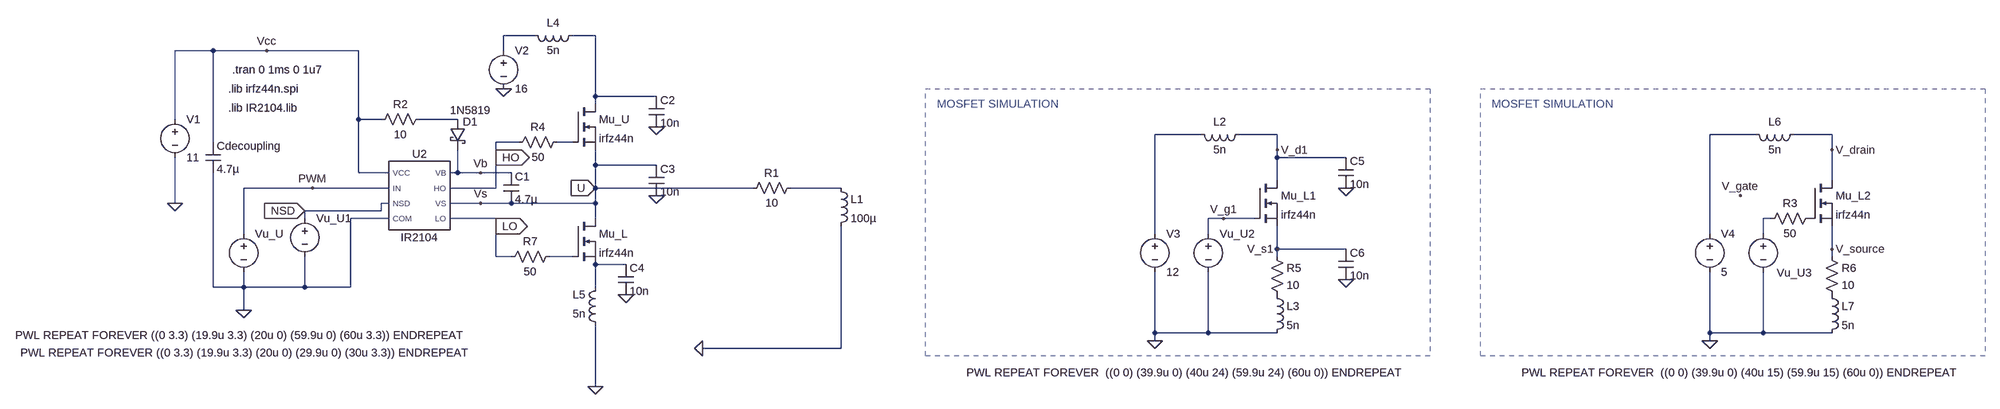
[diagram p0: schematic single_fet_driver.asc]
single_fet_driver.asc, the LTspice schematic file:
Version 4
SHEET 1 3064 1880
WIRE -528 -640 -592 -640
WIRE -400 -640 -448 -640
WIRE -1200 -608 -1280 -608
WIRE -1088 -608 -1200 -608
WIRE -896 -608 -1088 -608
WIRE -592 -608 -592 -640
WIRE -400 -512 -400 -640
WIRE -272 -512 -400 -512
WIRE -400 -496 -400 -512
WIRE -1280 -464 -1280 -608
WIRE -896 -464 -896 -608
WIRE -848 -464 -896 -464
WIRE -688 -464 -768 -464
WIRE 992 -432 896 -432
WIRE 1152 -432 1072 -432
WIRE 2160 -432 2064 -432
WIRE 2320 -432 2240 -432
WIRE -1200 -416 -1200 -608
WIRE -560 -416 -608 -416
WIRE -448 -416 -480 -416
WIRE 1152 -400 1152 -432
WIRE 2320 -400 2320 -432
WIRE -608 -384 -608 -416
WIRE 1152 -384 1152 -400
WIRE 1296 -384 1152 -384
WIRE -400 -368 -400 -400
WIRE -272 -368 -400 -368
WIRE -896 -352 -896 -464
WIRE -832 -352 -896 -352
WIRE -688 -352 -688 -400
WIRE -688 -352 -704 -352
WIRE -640 -352 -688 -352
WIRE -576 -352 -640 -352
WIRE 1152 -336 1152 -384
WIRE 2320 -336 2320 -400
WIRE -992 -320 -1136 -320
WIRE -832 -320 -992 -320
WIRE -608 -320 -608 -384
WIRE -608 -320 -704 -320
WIRE -400 -320 -400 -368
WIRE -64 -320 -400 -320
WIRE 128 -320 16 -320
WIRE -1280 -288 -1280 -384
WIRE -832 -288 -848 -288
WIRE -640 -288 -704 -288
WIRE -576 -288 -640 -288
WIRE -400 -288 -400 -320
WIRE -400 -288 -576 -288
WIRE -848 -272 -848 -288
WIRE -848 -272 -1008 -272
WIRE -1008 -256 -1008 -272
WIRE -832 -256 -912 -256
WIRE -608 -256 -704 -256
WIRE -400 -256 -400 -288
WIRE 1040 -256 1008 -256
WIRE 1104 -256 1040 -256
WIRE 2192 -256 2176 -256
WIRE -608 -240 -608 -256
WIRE -1136 -224 -1136 -320
WIRE 896 -224 896 -432
WIRE 1008 -224 1008 -256
WIRE 2064 -224 2064 -432
WIRE 2176 -224 2176 -256
WIRE 1152 -192 1152 -240
WIRE 1296 -192 1152 -192
WIRE 2320 -192 2320 -240
WIRE -608 -176 -608 -240
WIRE -576 -176 -608 -176
WIRE -448 -176 -496 -176
WIRE 1152 -176 1152 -192
WIRE 2320 -176 2320 -192
WIRE -336 -160 -400 -160
WIRE -1200 -112 -1200 -352
WIRE -1136 -112 -1136 -144
WIRE -1136 -112 -1200 -112
WIRE -1008 -112 -1008 -176
WIRE -1008 -112 -1136 -112
WIRE -912 -112 -912 -256
WIRE -912 -112 -1008 -112
WIRE -400 -112 -400 -160
WIRE -1136 -64 -1136 -112
WIRE 896 -16 896 -144
WIRE 1008 -16 1008 -144
WIRE 1008 -16 896 -16
WIRE 1152 -16 1008 -16
WIRE 2064 -16 2064 -144
WIRE 2176 -16 2176 -144
WIRE 2176 -16 2064 -16
WIRE 2320 -16 2176 -16
WIRE 896 0 896 -16
WIRE 2064 0 2064 -16
WIRE 128 16 128 -240
WIRE 128 16 -176 16
WIRE -400 96 -400 -32
FLAG -1136 -64 0
FLAG -176 16 0
FLAG -1280 -288 0
FLAG -1008 -272 NSD
IOPIN -1008 -272 In
FLAG -640 -288 Vs
FLAG -640 -352 Vb
FLAG -608 -384 HO
IOPIN -608 -384 Out
FLAG -608 -240 LO
IOPIN -608 -240 Out
FLAG -400 -320 U
IOPIN -400 -320 In
FLAG -1088 -608 Vcc
FLAG -592 -528 0
FLAG -992 -320 PWM
FLAG 1152 -400 V_d1
FLAG 1040 -256 V_g1
FLAG 1152 -192 V_s1
FLAG -272 -304 0
FLAG -272 -448 0
FLAG -336 -96 0
FLAG 1296 -320 0
FLAG 1296 -128 0
FLAG 896 0 0
FLAG 2320 -400 V_drain
FLAG 2128 -304 V_gate
FLAG 2320 -192 V_source
FLAG 2064 0 0
FLAG -400 96 0
SYMBOL nmos -448 -256 R0
SYMATTR InstName Mu_L
SYMATTR Value irfz44n
SYMATTR Prefix X
SYMBOL nmos -448 -496 R0
SYMATTR InstName Mu_U
SYMATTR Value irfz44n
SYMATTR Prefix X
SYMBOL voltage -1136 -240 R0
WINDOW 3 -478 229 Left 2
SYMATTR Value PWL REPEAT FOREVER ((0 3.3) (19.9u 3.3) (20u 0) (59.9u 0) (60u 3.3)) ENDREPEAT
SYMATTR InstName Vu_U
SYMBOL voltage -1280 -480 R0
WINDOW 123 0 0 Left 0
WINDOW 39 0 0 Left 0
SYMATTR InstName V1
SYMATTR Value 11
SYMBOL schottky -704 -464 R0
WINDOW 0 27 5 Left 2
WINDOW 3 0 -19 Left 2
SYMATTR InstName D1
SYMATTR Value 1N5819
SYMATTR Description Diode
SYMATTR Type diode
SYMBOL cap -592 -352 R0
SYMATTR InstName C1
SYMATTR Value 4.7µ
SYMBOL voltage -1008 -272 R0
WINDOW 3 -595 297 Left 2
SYMATTR Value PWL REPEAT FOREVER ((0 3.3) (19.9u 3.3) (20u 0) (29.9u 0) (30u 3.3)) ENDREPEAT
SYMATTR InstName Vu_U1
SYMBOL res 32 -336 R90
WINDOW 0 0 56 VBottom 2
WINDOW 3 32 56 VTop 2
SYMATTR InstName R1
SYMATTR Value 10
SYMBOL voltage -592 -624 R0
WINDOW 123 0 0 Left 0
WINDOW 39 0 0 Left 0
SYMATTR InstName V2
SYMATTR Value 16
SYMBOL ind 112 -336 R0
SYMATTR InstName L1
SYMATTR Value 100µ
SYMBOL cap -1216 -416 R0
SYMATTR InstName Cdecoupling
SYMATTR Value 4.7µ
SYMBOL AutoGenerated\\IR2104 -768 -304 R0
SYMATTR InstName U2
SYMBOL nmos 1104 -336 R0
SYMATTR InstName Mu_L1
SYMATTR Value irfz44n
SYMATTR Prefix X
SYMBOL voltage 1008 -240 R0
WINDOW 3 -506 307 Left 2
SYMATTR Value PWL REPEAT FOREVER  ((0 0) (39.9u 0) (40u 24) (59.9u 24) (60u 0)) ENDREPEAT
SYMATTR InstName Vu_U2
SYMBOL voltage 896 -240 R0
WINDOW 123 0 0 Left 0
WINDOW 39 0 0 Left 0
SYMATTR InstName V3
SYMATTR Value 12
SYMBOL res 1136 -192 R0
SYMATTR InstName R5
SYMATTR Value 10
SYMBOL cap -288 -512 R0
SYMATTR InstName C2
SYMATTR Value 10n
SYMATTR SpiceLine Rser=1
SYMBOL cap -288 -368 R0
SYMATTR InstName C3
SYMATTR Value 10n
SYMATTR SpiceLine Rser=1
SYMBOL cap -352 -160 R0
SYMATTR InstName C4
SYMATTR Value 10n
SYMATTR SpiceLine Rser=1
SYMBOL cap 1280 -384 R0
SYMATTR InstName C5
SYMATTR Value 10n
SYMATTR SpiceLine Rser=1
SYMBOL cap 1280 -192 R0
SYMATTR InstName C6
SYMATTR Value 10n
SYMATTR SpiceLine Rser=1
SYMBOL ind 1088 -448 R90
WINDOW 0 5 56 VBottom 2
WINDOW 3 32 56 VTop 2
SYMATTR InstName L2
SYMATTR Value 5n
SYMBOL ind 1136 -112 R0
SYMATTR InstName L3
SYMATTR Value 5n
SYMBOL ind -432 -656 R90
WINDOW 0 5 56 VBottom 2
WINDOW 3 32 56 VTop 2
SYMATTR InstName L4
SYMATTR Value 5n
SYMBOL ind -384 -16 R180
WINDOW 0 36 80 Left 2
WINDOW 3 36 40 Left 2
SYMATTR InstName L5
SYMATTR Value 5n
SYMBOL nmos 2272 -336 R0
SYMATTR InstName Mu_L2
SYMATTR Value irfz44n
SYMATTR Prefix X
SYMBOL voltage 2176 -240 R0
WINDOW 3 -506 307 Left 2
WINDOW 0 28 98 Left 2
SYMATTR Value PWL REPEAT FOREVER  ((0 0) (39.9u 0) (40u 15) (59.9u 15) (60u 0)) ENDREPEAT
SYMATTR InstName Vu_U3
SYMBOL voltage 2064 -240 R0
WINDOW 123 0 0 Left 0
WINDOW 39 0 0 Left 0
SYMATTR InstName V4
SYMATTR Value 5
SYMBOL res 2304 -192 R0
SYMATTR InstName R6
SYMATTR Value 10
SYMBOL ind 2256 -448 R90
WINDOW 0 5 56 VBottom 2
WINDOW 3 32 56 VTop 2
SYMATTR InstName L6
SYMATTR Value 5n
SYMBOL ind 2304 -112 R0
SYMATTR InstName L7
SYMATTR Value 5n
SYMBOL res 2288 -272 R90
WINDOW 0 0 56 VBottom 2
WINDOW 3 32 56 VTop 2
SYMATTR InstName R3
SYMATTR Value 50
SYMBOL res -464 -432 R90
WINDOW 0 0 56 VBottom 2
WINDOW 3 32 56 VTop 2
SYMATTR InstName R4
SYMATTR Value 50
SYMBOL res -480 -192 R90
WINDOW 0 0 56 VBottom 2
WINDOW 3 32 56 VTop 2
SYMATTR InstName R7
SYMATTR Value 50
SYMBOL res -752 -480 R90
WINDOW 0 0 56 VBottom 2
WINDOW 3 32 56 VTop 2
SYMATTR InstName R2
SYMATTR Value 10
TEXT -1160 -568 Left 2 !.tran 0 1ms 0 1u7
TEXT -1168 -528 Left 2 !.lib irfz44n.spi
TEXT -1168 -488 Left 2 !.lib IR2104.lib
TEXT 440 -496 Left 2 ;MOSFET SIMULATION
TEXT 1608 -496 Left 2 ;MOSFET SIMULATION
RECTANGLE Normal 1472 32 416 -528 2
RECTANGLE Normal 2640 32 1584 -528 2

The netlist it stands for:
* single_fet_driver.asc
XMu_L U N009 N010 irfz44n  ; pins D G S
XMu_U N002 N006 U irfz44n  ; pins D G S
Vu_U PWM 0 PWL REPEAT FOREVER ((0 3.3) (19.9u 3.3) (20u 0) (59.9u 0) (60u 3.3)) ENDREPEAT
V1 Vcc 0 11
D1 N003 Vb 1N5819
C1 Vb U 4.7µ
Vu_U1 NSD 0 PWL REPEAT FOREVER ((0 3.3) (19.9u 3.3) (20u 0) (29.9u 0) (30u 3.3)) ENDREPEAT
R1 N007 U 10
V2 N001 0 16
L1 N007 0 100µ
Cdecoupling Vcc 0 4.7µ
XU2 LO HO 0 PWM Vcc Vb U NSD IR2104  ; pins LO HO COM IN VCC VB VS NSD
XMu_L1 V_d1 V_g1 V_s1 irfz44n  ; pins D G S
Vu_U2 V_g1 0 PWL REPEAT FOREVER  ((0 0) (39.9u 0) (40u 24) (59.9u 24) (60u 0)) ENDREPEAT
V3 N004 0 12
R5 V_s1 P001 10
C2 N002 0 10n Rser=1
C3 U 0 10n Rser=1
C4 N010 0 10n Rser=1
C5 V_d1 0 10n Rser=1
C6 V_s1 0 10n Rser=1
L2 V_d1 N004 5n
L3 P001 0 5n
L4 N002 N001 5n
L5 0 N010 5n
XMu_L2 V_drain P002 V_source irfz44n  ; pins D G S
Vu_U3 N008 0 PWL REPEAT FOREVER  ((0 0) (39.9u 0) (40u 15) (59.9u 15) (60u 0)) ENDREPEAT
V4 N005 0 5
R6 V_source P003 10
L6 V_drain N005 5n
L7 P003 0 5n
R3 P002 N008 50
R4 N006 HO 50
R7 N009 LO 50
R2 N003 Vcc 10
.model D D
.lib standard.dio
.tran 0 1ms 0 1u7
.lib irfz44n.spi
.lib IR2104.lib
* MOSFET SIMULATION
* MOSFET SIMULATION
.lib C:\users\iwolfs\My Documents\LTspiceXVII\lib\other\IR2104\Model\IR2104.lib
.backanno
.end